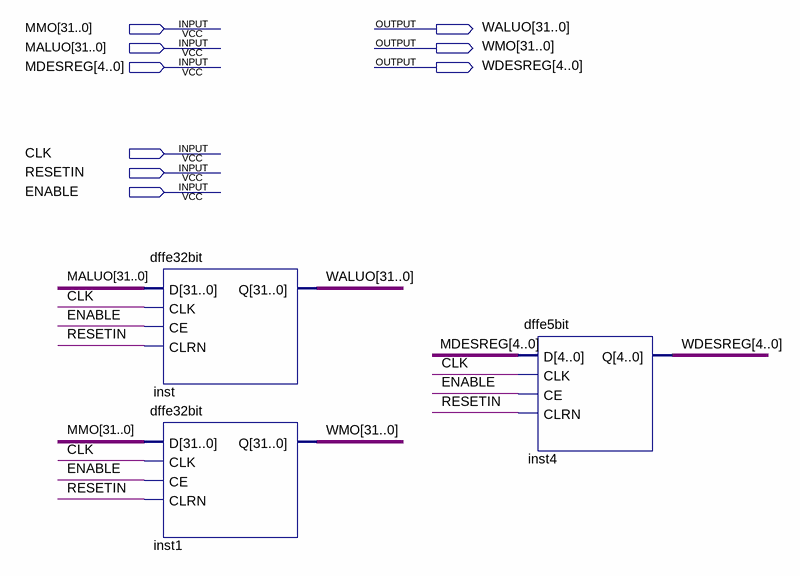
[diagram p0: schematic sheet]
// Quartus schematic MEM-WB-INSTDATA-BUFFER.bdf as structural Verilog: 3 symbols, 9 pins
module \MEM-WB-INSTDATA-BUFFER  (
  input  [31:0] MMO,
  input  [31:0] MALUO,
  input  [4:0] MDESREG,
  input  CLK,
  input  RESETIN,
  input  ENABLE,
  output [31:0] WALUO,
  output [31:0] WMO,
  output [4:0] WDESREG
);

  dffe32bit inst (.D(MALUO), .CLK(CLK), .CE(ENABLE), .CLRN(RESETIN), .Q(WALUO));
  dffe32bit inst1 (.D(MMO), .CLK(CLK), .CE(ENABLE), .CLRN(RESETIN), .Q(WMO));
  dffe5bit inst4 (.D(MDESREG), .CLK(CLK), .CE(ENABLE), .CLRN(RESETIN), .Q(WDESREG));
endmodule
